# Altium schematic sheet EST_MainV20_Output.SchDoc
size A4
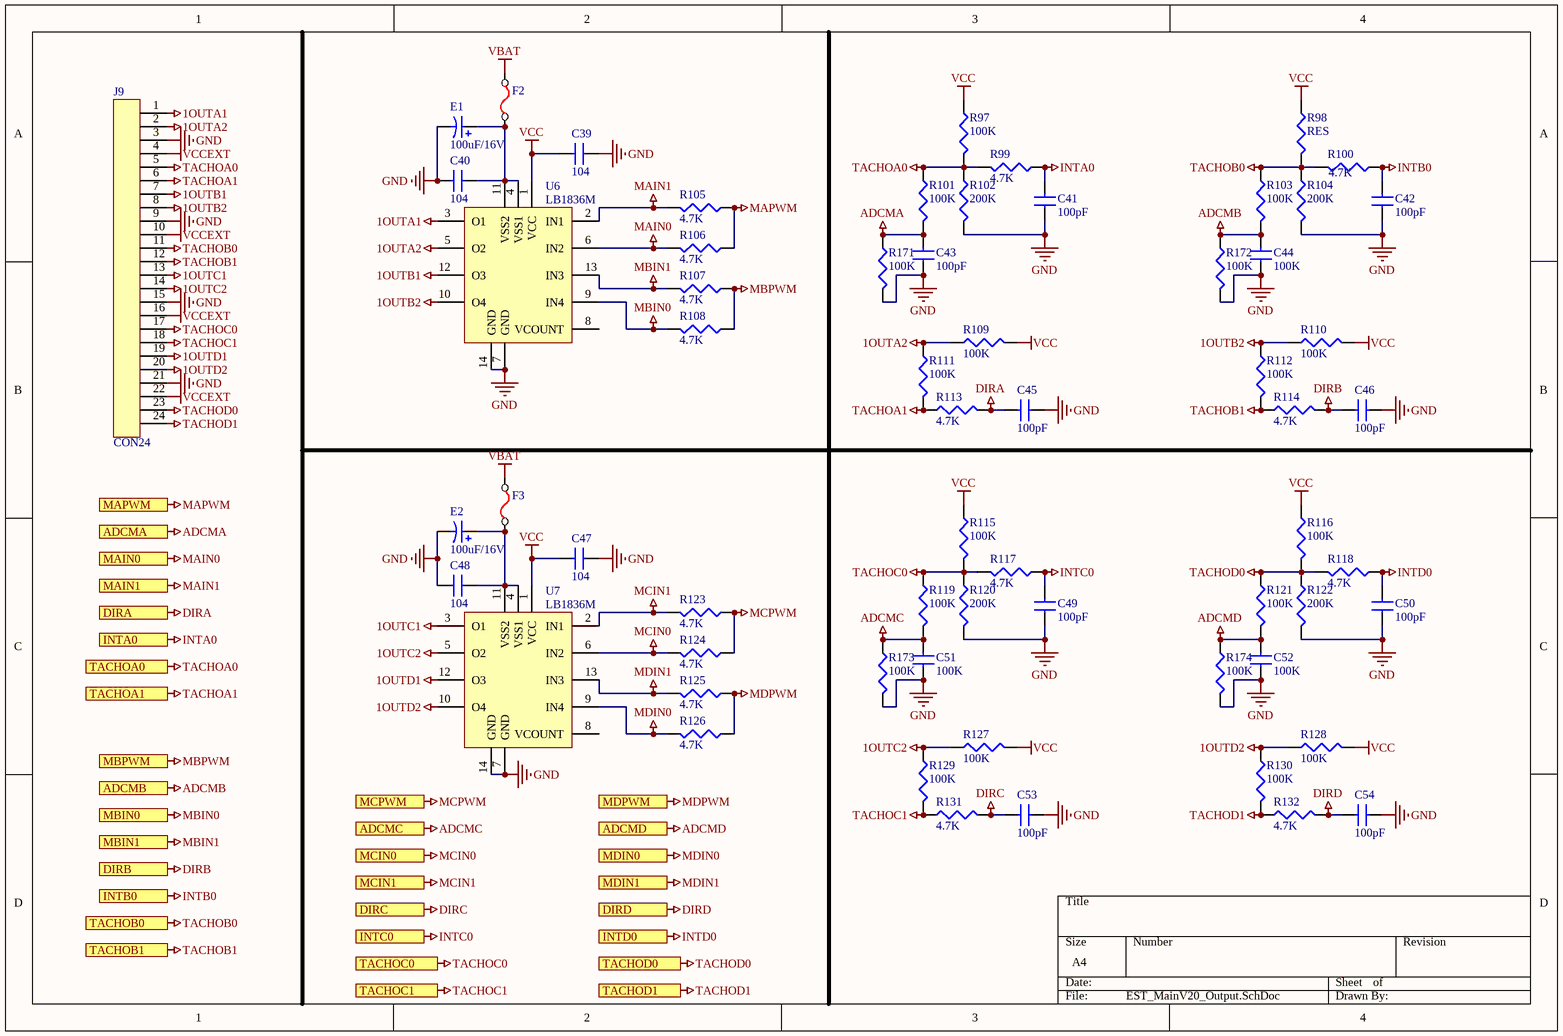
[diagram p0: EST_MainV20_Output.SchDoc]

## Parts
C39  104  [CAP_0603]
C40  104  [CAP_0603]
C41  100pF  [CAP_0603]
C42  100pF  [CAP_0603]
C43  100pF  [CAP_0603]
C44  100K  [CAP_0603]
C45  100pF  [CAP_0603]
C46  100pF  [CAP_0603]
C47  104  [CAP_0603]
C48  104  [CAP_0603]
C49  100pF  [CAP_0603]
C50  100pF  [CAP_0603]
C51  100K  [CAP_0603]
C52  100K  [CAP_0603]
C53  100pF  [CAP_0603]
C54  100pF  [CAP_0603]
E1  100uF/16V  [1812]
E2  100uF/16V  [1812]
F2  FUSE  [1812]  (value not drawn)
F3  FUSE  [1812]  (value not drawn)
J9  CON24  [RJ11-4]
R97  100K  [RES_0603]
R98  RES  [RES_0603]
R99  4.7K  [RES_0603]
R100  4.7K  [RES_0603]
R101  100K  [RES_0603]
R102  200K  [RES_0603]
R103  100K  [RES_0603]
R104  200K  [RES_0603]
R105  4.7K  [RES_0603]
R106  4.7K  [RES_0603]
R107  4.7K  [RES_0603]
R108  4.7K  [RES_0603]
R109  100K  [RES_0603]
R110  100K  [RES_0603]
R111  100K  [RES_0603]
R112  100K  [RES_0603]
R113  4.7K  [RES_0603]
R114  4.7K  [RES_0603]
R115  100K  [RES_0603]
R116  100K  [RES_0603]
R117  4.7K  [RES_0603]
R118  4.7K  [RES_0603]
R119  100K  [RES_0603]
R120  200K  [RES_0603]
R121  100K  [RES_0603]
R122  200K  [RES_0603]
R123  4.7K  [RES_0603]
R124  4.7K  [RES_0603]
R125  4.7K  [RES_0603]
R126  4.7K  [RES_0603]
R127  100K  [RES_0603]
R128  100K  [RES_0603]
R129  100K  [RES_0603]
R130  100K  [RES_0603]
R131  4.7K  [RES_0603]
R132  4.7K  [RES_0603]
R171  100K  [RES_0603]
R172  100K  [RES_0603]
R173  100K  [RES_0603]
R174  100K  [RES_0603]
U6  LB1836M  [LB1836]
U7  LB1836M  [LB1836]

## Ports
ADCMA, ADCMB, ADCMC, ADCMD, DIRA, DIRB, DIRC, DIRD, INTA0, INTB0, INTC0, INTD0, MAIN0, MAIN1, MAPWM, MBIN0, MBIN1, MBPWM, MCIN0, MCIN1, MCPWM, MDIN0, MDIN1, MDPWM, TACHOA0, TACHOA1, TACHOB0, TACHOB1, TACHOC0, TACHOC1, TACHOD0, TACHOD1

## Nets
1OUTA1: J9.1 U6.3(O1)
1OUTA2: J9.2 R109.2(BOT) R111.2(BOT) U6.5(O2)
1OUTB1: J9.7 U6.12(O3)
1OUTB2: J9.8 R110.2(BOT) R112.2(BOT) U6.10(O4)
1OUTC1: J9.13 U7.3(O1)
1OUTC2: J9.14 R127.2(BOT) R129.2(BOT) U7.5(O2)
1OUTD1: J9.19 U7.12(O3)
1OUTD2: J9.20 R128.2(BOT) R130.2(BOT) U7.10(O4)
ADCMA: C43.2 R101.1(TOP) R171.2(BOT) ; port ADCMA
ADCMB: C44.2 R103.1(TOP) R172.2(BOT) ; port ADCMB
ADCMC: C51.2 R119.1(TOP) R173.2(BOT) ; port ADCMC
ADCMD: C52.2 R121.1(TOP) R174.2(BOT) ; port ADCMD
DIRA: C45.2 R113.1(TOP) ; port DIRA
DIRB: C46.2 R114.1(TOP) ; port DIRB
DIRC: C53.2 R131.1(TOP) ; port DIRC
DIRD: C54.2 R132.1(TOP) ; port DIRD
GND: C39.2 C40.1 C41.1 C42.1 C43.1 C44.1 C45.1 C46.1 C47.2 C48.1 C49.1 C50.1 C51.1 C52.1 C53.1 C54.1 E1.2 E2.2 J9.3 J9.9 J9.15 J9.21 R102.1(TOP) R104.1(TOP) R120.1(TOP) R122.1(TOP) R171.1(TOP) R172.1(TOP) R173.1(TOP) R174.1(TOP) U6.7(GND) U6.14(GND) U7.7(GND) U7.14(GND)
INTA0: C41.2 R99.2(BOT) ; port INTA0
INTB0: C42.2 R100.2(BOT) ; port INTB0
INTC0: C49.2 R117.2(BOT) ; port INTC0
INTD0: C50.2 R118.2(BOT) ; port INTD0
MAIN0: R106.1(TOP) U6.6(IN2) ; port MAIN0
MAIN1: R105.1(TOP) U6.2(IN1) ; port MAIN1
MAPWM: R105.2(BOT) R106.2(BOT) ; port MAPWM
MBIN0: R108.1(TOP) U6.9(IN4) ; port MBIN0
MBIN1: R107.1(TOP) U6.13(IN3) ; port MBIN1
MBPWM: R107.2(BOT) R108.2(BOT) ; port MBPWM
MCIN0: R124.1(TOP) U7.6(IN2) ; port MCIN0
MCIN1: R123.1(TOP) U7.2(IN1) ; port MCIN1
MCPWM: R123.2(BOT) R124.2(BOT) ; port MCPWM
MDIN0: R126.1(TOP) U7.9(IN4) ; port MDIN0
MDIN1: R125.1(TOP) U7.13(IN3) ; port MDIN1
MDPWM: R125.2(BOT) R126.2(BOT) ; port MDPWM
TACHOA0: J9.5 R97.1(TOP) R99.1(TOP) R101.2(BOT) R102.2(BOT) ; port TACHOA0
TACHOA1: J9.6 R111.1(TOP) R113.2(BOT) ; port TACHOA1
TACHOB0: J9.11 R98.1(TOP) R100.1(TOP) R103.2(BOT) R104.2(BOT) ; port TACHOB0
TACHOB1: J9.12 R112.1(TOP) R114.2(BOT) ; port TACHOB1
TACHOC0: J9.17 R115.1(TOP) R117.1(TOP) R119.2(BOT) R120.2(BOT) ; port TACHOC0
TACHOC1: J9.18 R129.1(TOP) R131.2(BOT) ; port TACHOC1
TACHOD0: J9.23 R116.1(TOP) R118.1(TOP) R121.2(BOT) R122.2(BOT) ; port TACHOD0
TACHOD1: J9.24 R130.1(TOP) R132.2(BOT) ; port TACHOD1
VBAT: F2.1 F3.1
VCC: C39.1 C47.1 R97.2(BOT) R98.2(BOT) R109.1(TOP) R110.1(TOP) R115.2(BOT) R116.2(BOT) R127.1(TOP) R128.1(TOP) U6.1(VCC) U7.1(VCC)
VCCEXT: J9.4 J9.10 J9.16 J9.22
NetC40_2: C40.2 E1.1 F2.2 U6.4(VSS1) U6.11(VSS2)
NetC48_2: C48.2 E2.1 F3.2 U7.4(VSS1) U7.11(VSS2)

Not connected (* = marked no-connect by the designer): U6 8(VCOUNT); U7 8(VCOUNT)

## Library data of the parts
C39-C54 = CAP: Capacitor
E1 E2 = CAP2: Bi-Polar Capacitor
R97-R132 R171-R174 = RES: Resistor
U6 U7 = LM1836